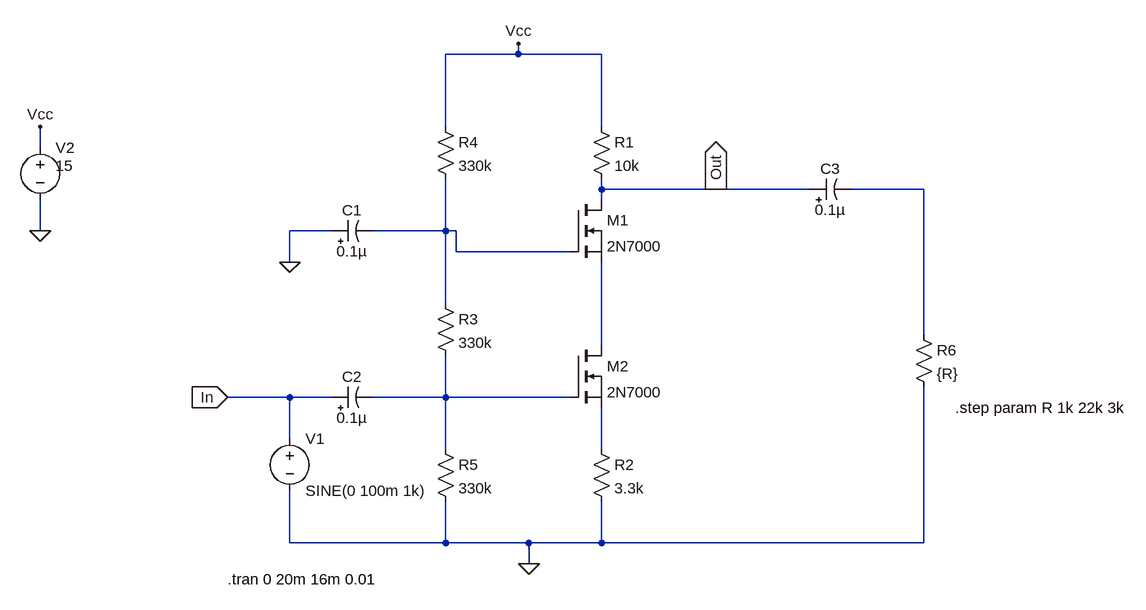
[diagram p0: schematic moschar_04_02_03_cgcs_rout.asc]
moschar_04_02_03_cgcs_rout.asc, the LTspice schematic file:
Version 4
SHEET 1 1036 680
WIRE 48 -192 48 -208
WIRE 48 -192 -64 -192
WIRE 176 -192 48 -192
WIRE -64 -80 -64 -192
WIRE 176 -80 176 -192
WIRE -688 -48 -688 -80
WIRE 176 16 176 0
WIRE 352 16 176 16
WIRE 496 16 352 16
WIRE 672 16 560 16
WIRE 176 32 176 16
WIRE -688 80 -688 32
WIRE -240 80 -304 80
WIRE -64 80 -64 0
WIRE -64 80 -176 80
WIRE -48 80 -64 80
WIRE -48 112 -48 80
WIRE 128 112 -48 112
WIRE -304 128 -304 80
WIRE -64 192 -64 80
WIRE 672 240 672 16
WIRE 176 256 176 128
WIRE -304 336 -400 336
WIRE -240 336 -304 336
WIRE -64 336 -64 272
WIRE -64 336 -176 336
WIRE 128 336 -64 336
WIRE -304 400 -304 336
WIRE -64 416 -64 336
WIRE 176 416 176 352
WIRE -304 560 -304 480
WIRE -64 560 -64 496
WIRE -64 560 -304 560
WIRE 64 560 -64 560
WIRE 176 560 176 496
WIRE 176 560 64 560
WIRE 672 560 672 320
WIRE 672 560 176 560
WIRE 64 592 64 560
FLAG -304 128 0
FLAG 64 592 0
FLAG -400 336 In
IOPIN -400 336 In
FLAG 352 16 Out
IOPIN 352 16 Out
FLAG -688 80 0
FLAG -688 -80 Vcc
FLAG 48 -208 Vcc
SYMBOL res 160 -96 R0
SYMATTR InstName R1
SYMATTR Value 10k
SYMBOL res 160 400 R0
SYMATTR InstName R2
SYMATTR Value 3.3k
SYMBOL res -80 176 R0
SYMATTR InstName R3
SYMATTR Value 330k
SYMBOL res -80 -96 R0
SYMATTR InstName R4
SYMATTR Value 330k
SYMBOL res -80 400 R0
SYMATTR InstName R5
SYMATTR Value 330k
SYMBOL polcap -240 96 R270
WINDOW 0 32 32 VTop 2
WINDOW 3 0 32 VBottom 2
SYMATTR InstName C1
SYMATTR Value 0.1µ
SYMBOL polcap -240 352 R270
WINDOW 0 32 32 VTop 2
WINDOW 3 0 32 VBottom 2
SYMATTR InstName C2
SYMATTR Value 0.1µ
SYMBOL voltage -304 384 R0
WINDOW 123 0 0 Left 2
WINDOW 39 0 0 Left 2
SYMATTR InstName V1
SYMATTR Value SINE(0 100m 1k)
SYMBOL voltage -688 -64 R0
WINDOW 3 24 44 Left 2
WINDOW 123 0 0 Left 2
WINDOW 39 0 0 Left 2
SYMATTR Value 15
SYMATTR InstName V2
SYMBOL polcap 496 32 R270
WINDOW 0 32 32 VTop 2
WINDOW 3 0 32 VBottom 2
SYMATTR InstName C3
SYMATTR Value 0.1µ
SYMBOL res 656 224 R0
SYMATTR InstName R6
SYMATTR Value {R}
SYMBOL nmos 128 32 R0
SYMATTR InstName M1
SYMATTR Value 2N7000
SYMBOL nmos 128 256 R0
SYMATTR InstName M2
SYMATTR Value 2N7000
TEXT -400 616 Left 2 !.tran 0 20m 16m 0.01
TEXT 720 352 Left 2 !.step param R 1k 22k 3k

The netlist it stands for:
* moschar_04_02_03_cgcs_rout.asc
R1 Vcc Out 10k
R2 N005 0 3.3k
R3 N002 N004 330k
R4 Vcc N002 330k
R5 N004 0 330k
C1 0 N002 0.1µ
C2 In N004 0.1µ
V1 In 0 SINE(0 100m 1k)
V2 Vcc 0 15
C3 Out N001 0.1µ
R6 N001 0 {R}
M1 Out N002 N003 N003 2N7000
M2 N003 N004 N005 N005 2N7000
.model NMOS NMOS
.model PMOS PMOS
.lib standard.mos
.tran 0 20m 16m 0.01
.step param R 1k 22k 3k
.backanno
.end